# EAGLE design clock10 (EAGLE 7.7.0)

## Sheet 1 of 2
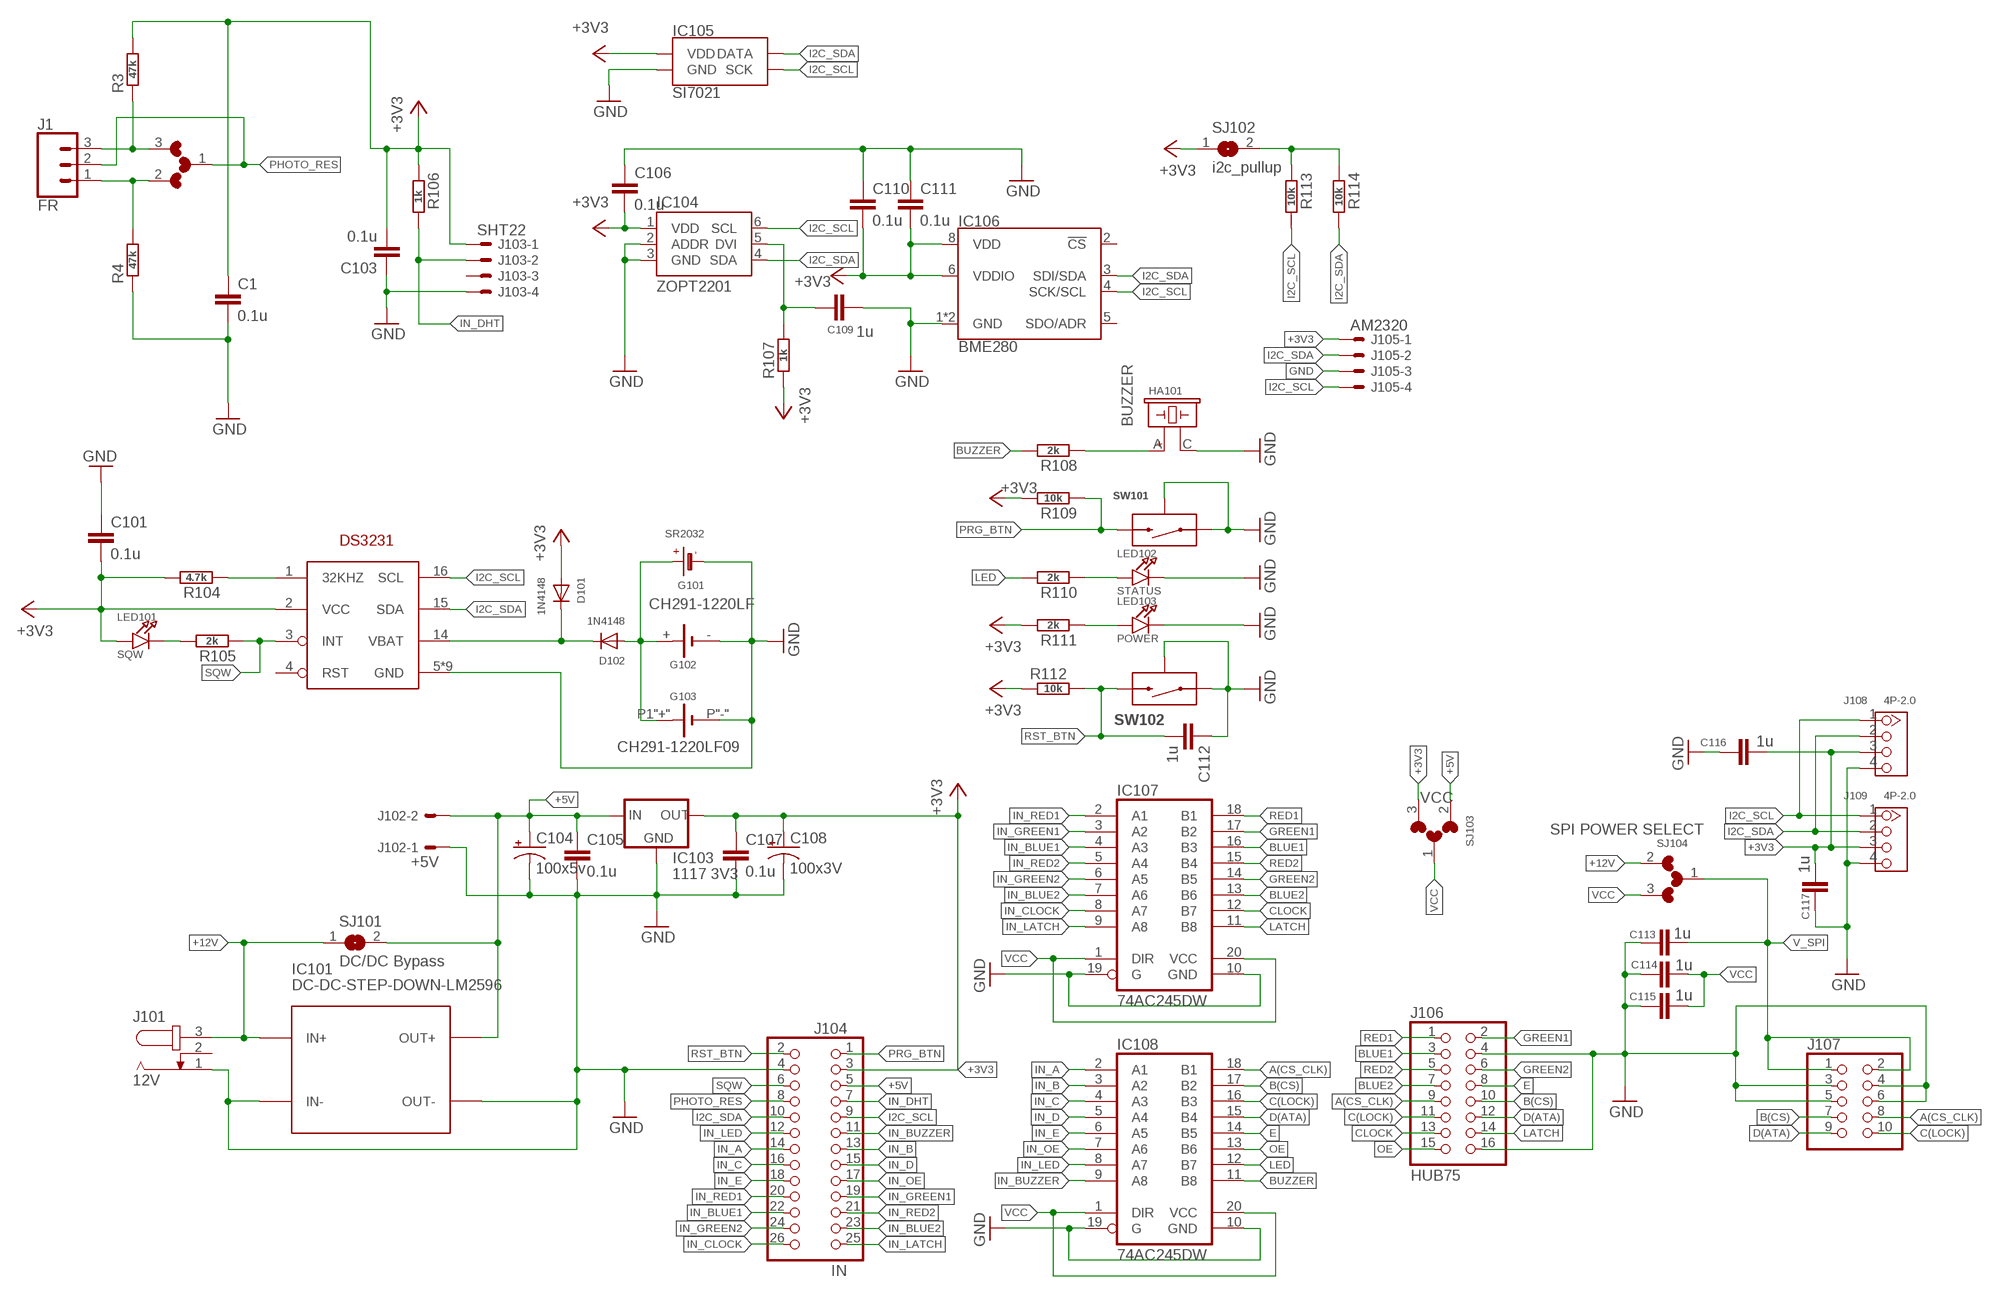
[diagram p0: schematic, sheet 1]

### Parts
C1  0.1u  CAP0603-CAP  [0603-CAP]
C101  0.1u  CAP0603-CAP  [0603-CAP]
C103  0.1u  CAP0603-CAP  [0603-CAP]
C104  100x5v  CAP_POLPTH1  [CPOL-RADIAL-100UF-25V]
C105  0.1u  CAP0603-CAP  [0603-CAP]
C106  0.1u  CAP0603-CAP  [0603-CAP]
C107  0.1u  CAP0603-CAP  [0603-CAP]
C108  100x3V  CAP_POLPTH1  [CPOL-RADIAL-100UF-25V]
C109  1u  CAP0603-CAP  [0603-CAP]
C110  0.1u  CAP0603-CAP  [0603-CAP]
C111  0.1u  CAP0603-CAP  [0603-CAP]
C112  1u  CAP0603-CAP  [0603-CAP]
C113  1u  CAP0603-CAP  [0603-CAP]
C114  1u  CAP0603-CAP  [0603-CAP]
C115  1u  CAP0603-CAP  [0603-CAP]
C116  1u  CAP0603-CAP  [0603-CAP]
C117  1u  CAP0603-CAP  [0603-CAP]
D101  1N4148  DIODESOD-323F  [SOD-323F]
D102  1N4148  DIODESOD-323F  [SOD-323F]
G101  SR2032  BATTERYCR2032  [CR2032]
G102  CH291-1220LF  [CH291-1220LF]
G103  CH291-1220LF09  [CH23-09LF]
HA101  BUZZER  PIEZO_BUZZERHYDZ12X7.5  [PBUZ_12X7.5]
IC101  DC-DC-STEP-DOWN-LM2596  [DC-DC-STEP-DOWN-LM2596]
IC102  DS3231W  [SO16W]
IC103  1117 3V3  V_REG_LD1117VXXSMD  [SOT223]
IC104  ZOPT2201  BH1750  [WSOF6L]
IC105  SI7021  [DFN-6-3X3-SI7021]
IC106  BME280  [LGA-8-2.5X2.5]
IC107  74AC245DW  [SO20W]
IC108  74AC245DW  [SO20W]
J1  FR  CONN_03  [1X03]
J101  12V  JACK-PLUG0  [SPC4077]
J102  +5V  C-GRID-02-70543  [70543-02]
J103  SHT22  C-GRID-04-70543  [70543-04]
J104  IN  HEADER-2X13  [2X13]
J105  AM2320  C-GRID-04-70543  [70543-04]
J106  HUB75  PINHD-2X8  [2X08]
J107  HEADER-2X5IDC  [2X05_IDC]
J108  4P-2.0  GROVE-CONNECTOR-DIP(4P-2.0)  [HW4-2.0]
J109  4P-2.0  GROVE-CONNECTOR-DIP(4P-2.0)  [HW4-2.0]
LED101  SQW  LED0603  [CHIPLED_0603]
LED102  STATUS  LED0603  [CHIPLED_0603]
LED103  POWER  LED0603  [CHIPLED_0603]
R3  47k  R-EU_R0603  [R0603]
R4  47k  R-EU_R0603  [R0603]
R104  4.7k  R-EU_R0603  [R0603]
R105  2k  R-EU_R0603  [R0603]
R106  1k  R-EU_R0603  [R0603]
R107  1k  R-EU_R0603  [R0603]
R108  2k  R-EU_R0603  [R0603]
R109  10k  R-EU_R0603  [R0603]
R110  2k  R-EU_R0603  [R0603]
R111  2k  R-EU_R0603  [R0603]
R112  10k  R-EU_R0603  [R0603]
R113  10k  R-EU_R0603  [R0603]
R114  10k  R-EU_R0603  [R0603]
SJ1  PR POS/NEG  MICROBUILDER_SOLDERJUMPER3  [MICROBUILDER_SOLDERJUMPER_ARROW_NOPASTE_3]
SJ101  DC/DC Bypass  MICROBUILDER_SOLDERJUMPER  [MICROBUILDER_SOLDERJUMPER_ARROW_NOPASTE]
SJ102  i2c_pullup  MICROBUILDER_SOLDERJUMPER  [MICROBUILDER_SOLDERJUMPER_ARROW_NOPASTE]
SJ103  VCC  MICROBUILDER_SOLDERJUMPER3  [MICROBUILDER_SOLDERJUMPER_ARROW_NOPASTE_3]
SJ104  SPI POWER SELECT  MICROBUILDER_SOLDERJUMPER3  [MICROBUILDER_SOLDERJUMPER_ARROW_NOPASTE_3]
SW101  PRG  MICROSWITCH-BUTTON  [MICROPUSH-BUT_TOP]
SW102  RST  MICROSWITCH-BUTTON  [MICROPUSH-BUT_TOP]

### Nets
+3V3: C1.1 C101.2 C103.2 C106.2 C107.1 C108.1(+) C110.2 C111.2 C116.2 C117.2 D101.A IC102.2(VCC) IC103.2(OUT) IC103.4(OUT) IC104.1(VDD) IC105.VDD IC106.6(VDDIO) IC106.8(VDD) J103.1 J104.3 J105.1 J108.3 J109.3 LED101.A R3.2 R104.2 R106.1 R107.1 R109.2 R111.2 R112.1 SJ102.1 SJ103.3
+5V: C104.1(+) C105.1 IC101.OUT+ IC103.3(IN) J102.2 J104.5 SJ101.2 SJ103.2
+12V: IC101.IN+ J101.3 SJ101.1 SJ104.2
A(CS_CLK): IC108.18(B1) J106.9 J107.8
B(CS): IC108.17(B2) J106.10 J107.7
BLUE1: IC107.16(B3) J106.3
BLUE2: IC107.13(B6) J106.7
BUZ: HA101.A R108.1
BUZZER: IC108.11(B8) R108.2
C(LOCK): IC108.16(B3) J106.11 J107.10
CLOCK: IC107.12(B7) J106.13
D(ATA): IC108.15(B4) J106.12 J107.9
E: IC108.14(B5) J106.8
GND: C1.2 C101.1 C103.1 C104.2(-) C105.2 C106.1 C107.2 C108.2(-) C109.2 C110.1 C111.1 C112.1 C113.2 C114.2 C115.2 C116.1 C117.1 G101.- G102.- G103.P"-"(-) HA101.C IC101.IN- IC101.OUT- IC102.5(GND) IC102.6(GND) IC102.7(GND) IC102.8(GND) IC102.9(GND) IC102.10(GND) IC102.11(GND) IC102.12(GND) IC102.13(GND) IC103.1(GND) IC104.2(ADDR) IC104.3(GND) IC105.GND IC106.1(GND) IC106.7(GND) IC107.10(GND) IC107.19(G) IC108.10(GND) IC108.19(G) J101.1 J102.1 J103.4 J104.4 J105.3 J106.4 J106.16 J107.3 J107.4 J107.5 J107.6 J108.4 J109.4 LED102.C LED103.C R4.1 SW101.A SW101.SH0(SH) SW102.A SW102.SH0(SH) ; also sheet 2
GREEN1: IC107.17(B2) J106.2
GREEN2: IC107.14(B5) J106.6
I2C_SCL: IC102.16(SCL) IC104.6(SCL) IC105.SCK IC106.4(SCK/SCL) J104.9 J105.4 J108.1 J109.1 R113.2
I2C_SDA: IC102.15(SDA) IC104.4(SDA) IC105.DATA IC106.3(SDI/SDA) J104.10 J105.2 J108.2 J109.2 R114.2
IN_A: IC108.2(A1) J104.14
IN_B: IC108.3(A2) J104.13
IN_BLUE1: IC107.4(A3) J104.22
IN_BLUE2: IC107.7(A6) J104.23
IN_BUZZER: IC108.9(A8) J104.11
IN_C: IC108.4(A3) J104.16
IN_CLOCK: IC107.8(A7) J104.26
IN_D: IC108.5(A4) J104.15
IN_DHT: J103.2 J104.7 R106.2
IN_E: IC108.6(A5) J104.18
IN_GREEN1: IC107.3(A2) J104.19
IN_GREEN2: IC107.6(A5) J104.24
IN_LATCH: IC107.9(A8) J104.25
IN_LED: IC108.8(A7) J104.12
IN_OE: IC108.7(A6) J104.17
IN_RED1: IC107.2(A1) J104.20
IN_RED2: IC107.5(A4) J104.21
LATCH: IC107.11(B8) J106.14
LED: IC108.12(B7) R110.2
N$1: D101.C D102.C IC102.14(VBAT)
N$2: LED103.A R111.1
N$4: J1.3 R3.1 SJ1.3
N$5: LED102.A R110.1
N$7: LED101.C R105.2
N$8: J1.1 R4.2 SJ1.2
N$25: C109.1 IC104.5(DVI) R107.2
N$32: IC102.1(32KHZ) R104.1
N$39: R113.1 R114.1 SJ102.2
N$52: D102.A G101.+ G102.+ G103.P1"+"(+)
OE: IC108.13(B6) J106.15
PHOTO_RES: J1.2 J104.8 SJ1.1
PRG_BTN: J104.1 R109.1 SW101.B
RED1: IC107.18(B1) J106.1
RED2: IC107.15(B4) J106.5
RST_BTN: C112.2 J104.2 R112.2 SW102.B
SQW: IC102.3(INT) J104.6 R105.1
V_SPI: C113.1 J107.1 J107.2 SJ104.1
VCC: C114.1 C115.1 IC107.1(DIR) IC107.20(VCC) IC108.1(DIR) IC108.20(VCC) SJ103.1 SJ104.3
Unconnected: IC102.4(RST) IC106.2(!CS) IC106.5(SDO/ADR) J101.2 J103.3

## Sheet 2 of 2
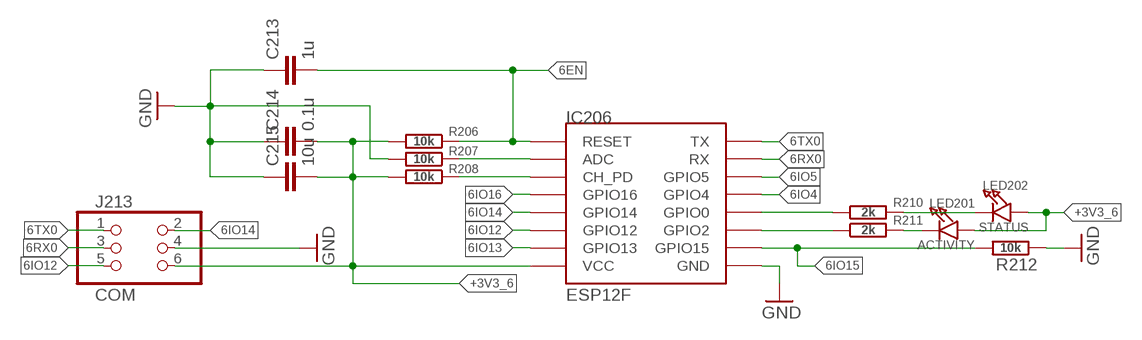
[diagram p1: schematic, sheet 2]

### Parts
C213  1u  CAP0603-CAP  [0603-CAP]
C214  0.1u  CAP0603-CAP  [0603-CAP]
C215  10u  CAP0603-CAP  [0603-CAP]
IC206  ESP12F  ESP12SMD  [ESP12-SMD]
J213  COM  HEADER-2X3SMT  [2X03_SMT]
LED201  ACTIVITY  LED0603  [CHIPLED_0603]
LED202  STATUS  LED0603  [CHIPLED_0603]
R206  10k  R-EU_R0603  [R0603]
R207  10k  R-EU_R0603  [R0603]
R208  10k  R-EU_R0603  [R0603]
R210  2k  R-EU_R0603  [R0603]
R211  2k  R-EU_R0603  [R0603]
R212  10k  R-EU_R0603  [R0603]

### Nets
6EN: C213.2 IC206.RESET R206.1
6IO0: IC206.GPIO0 R210.1
6IO2: IC206.GPIO2 R211.1
6IO4: IC206.GPIO4
6IO5: IC206.GPIO5
6IO12: IC206.GPIO12 J213.5
6IO13: IC206.GPIO13
6IO14: IC206.GPIO14 J213.2
6IO15: IC206.GPIO15 R212.2
6IO16: IC206.GPIO16
6RX0: IC206.RXD0(RX) J213.3
6TX0: IC206.TXD0(TX) J213.1
+3V3_6: C214.2 C215.2 IC206.VCC J213.6 LED201.A LED202.A R206.2 R208.2
GND: C213.1 C214.1 C215.1 IC206.GND J213.4 R207.2 R212.1 ; also sheet 1
N$9: IC206.CH_PD R208.1
N$10: IC206.ADC R207.1
N$11: LED202.C R210.2
N$12: LED201.C R211.2

## Library data of the parts
C1 C101 C103 C105-C107 C109-C117 C213-C215 = radiva5:CAP: Capacitor Standard 0603 ceramic capacitor, and 0.1" leaded capacitor.
C104 C108 = radiva5:CAP_POL: Capacitor Polarized These are standard SMD and PTH capacitors. Normally 10uF, 47uF, and 100uF in electrolytic and tantalum varieties. Always verify the external diameter of the through hole cap, it varies with capacity, voltage, and manufacturer. The EIA devices should be standard.
D101 D102 = clock02:DIODE: Diode SMADIODE - SMA Surface Mount Package 20V 1A Schottky Diode Digikey: 641-1014-6-ND DO-1N4148 - Through Hole Small Current Diode SOD-123 20V 1 A (.5mV Vf) Schottky Diode - Digikey: MBRX120TPMSCT-ND SOD-323 10V 570mA (.38mV Vf, 3ns) Schottky Diode - Digikey: ZLLS410CT-ND SOD-523 30V 30mA Schottky Diode (RB751S-40TE61) - Digikey: RB751S-40TE61CT-ND SOT23-R/W - SOT23 Package (R = Solder Paste/Reflow Ovens, W = Hand-Soldering) BAT54Film 40V 300mA - Digikey: 497-7162-1-ND
G101 = radiva5:BATTERY: CR1220 SMT - Digikey: 3001K-ND
G102 G103 = clock02:CH291-1220LF: Battery Holder, SMT, 12mm multicomp PART NO. CH291-1220LF Source: Data sheet <http://www.farnell.com/datasheets/1505860.pdf>
HA101 = radiva5:PIEZO_BUZZER: Generic Piezo Buzzer Package(s): 12 mm dia, 7.6 mm (Pitch)
IC101 = diy-modules:DC-DC-STEP-DOWN-LM2596: DC/DC Step-Down Regulator based on LM2596-ADJ chip LM2596 datasheet available here: http://www.ti.com/lit/ds/symlink/lm2596.pdf Click here to find device on ebay.com <http://www.ebay.com/sch/lm2596+power+regulator>
IC102 = radiva5:DS3231
IC103 = radiva5:V_REG_LD1117VXX: LD1117VXX voltage regulator. We carry the 3.3V version (COM-00526) in TO-220 package.; PROD_ID: VREG-13917
IC104 = radiva5:BH1750; PROD_ID: IC-13876
IC105 = radiva5:SI7021: Silicon Labs Si7021 I2C Humidity and Temperature Sensor The Si7021 is a low-cost, easy-to-use, highly accurate, digital humidity and temperature sensor. This sensor is ideal for environmental sensing and data logging and perfect for build a weather stations or humidor control system. All you need are two lines for I2C communication, and you’ll have relative humidity readings and very accurate temperature readings as a bonus! Datasheet <https://cdn.sparkfun.com/datasheets/Sensors/Weather/Si7021.pdf> SparkFun Products SparkFun Humidity and Temperature Sensor Breakout - Si7021 <https://www.sparkfun.com/products/13763> (SEN-13763) SparkFun Blynk Board - ESP8266 <https://www.sparkfun.com/products/13794> (WRL-13794); PROD_ID: IC-13093
IC106 = radiva5:BME280: Bosch BME280 – Combined Humidity and Pressure Sensor The BME280 is as combined digital humidity, pressure and temperature sensor based on proven sensing principles. The sensor module is housed in an extremely compact metal-lid LGA package with a footprint of only 2.5×2.5mm² with a height of 0.93mm. Its small dimensions and its low power consumption allow the implementation in battery driven devices such as handsets, GPS modules or watches. Datasheet <https://cdn.sparkfun.com/assets/learn_tutorials/4/1/9/BST-BME280_DS001-10.pdf> SparkFun Products SparkFun Atmospheric Sensor Breakout - BME280 <https://www.sparkfun.com/products/13676> (SEN-13676); PROD_ID: IC-13090
IC107 IC108 = 74xx-eu:74*245: Octal BUS TRANSCEIVER, 3-state
IC206 = esp8266modules:ESP12: ESP8266 Wifi module 12
J1 = radiva5:CONN_03: Multi connection point. Often used as Generic Header-pin footprint for 0.1 inch spaced/style header connections On any of the 0.1 inch spaced packages, you can populate with these: Break Away Headers - Straight <https://www.sparkfun.com/products/116> (PRT-00116) Break Away Male Headers - Right Angle <https://www.sparkfun.com/products/553> (PRT-00553) Female Headers <https://www.sparkfun.com/products/115> (PRT-00115) Break Away Headers - Machine Pin <https://www.sparkfun.com/products/117> (PRT-00117) Break Away Female Headers - Swiss Machine Pin <https://www.sparkfun.com/products/743> (PRT-00743) Stackable Header - 3 Pin (Female, 0.1") <https://www.sparkfun.com/products/13875> (PRT-13875) For SCREWTERMINALS and SPRING TERMINALS visit here: Screw Terimnals on SparkFun.com <https://www.sparkfun.com/search/results?term=Screw+Terminals> (5mm/3.5mm/2.54mm spacing) This device is also useful as a general connection point to wire up your design to another part of your project. Our various solder wires solder well into these plated through hole pads. Hook-Up Wire - Assortment (Stranded, 22 AWG) <https://www.sparkfun.com/products/11375> (PRT-11375) Hook-Up Wire - Assortment (Solid Core, 22 AWG) <https://www.sparkfun.com/products/11367> (PRT-11367) View the entire wire category on our website here <https://www.sparkfun.com/categories/141> Special notes: Molex polarized connector foot print use with SKU : PRT-08232 with associated crimp pins and housings.; PROD_ID: XXX-00000; VALUE: 455-1750-1-ND
J101 = con-jack:JACK-PLUG: DC POWER JACK Power Jack, DC, Right Angle, Through Hole, Rated 5A at 16VDC, PC Terminals Distributor: Farnell (www.Farnell.de) Drawing: 84N1161.pdf / 84N1162.pdf Manufacturer: SPC Technology (www.spctechnology.com) Type: SPC4077 / SPC 4078; OC_FARNELL: unknown; OC_NEWARK: unknown
J102 = con-molex:C-GRID-02: CONNECTOR wire to board 2.54 mm (0.100") pitch header; OC_FARNELL: unknown; OC_NEWARK: unknown
J103 J105 = con-molex:C-GRID-04: CONNECTOR wire to board 2.54 mm (0.100") pitch header; OC_FARNELL: unknown; OC_NEWARK: unknown
J104 = radiva5:HEADER-2X13: PIN HEADER
J106 = pinhead:PINHD-2X8: PIN HEADER
J107 = radiva5:HEADER-2X5: PIN HEADER
J108 J109 = radiva5:GROVE-CONNECTOR-DIP(4P-2.0): 320110033
J213 = radiva5:HEADER-2X3: PIN HEADER
LED101-LED103 LED201 LED202 = radiva5:LED: LED 0603 - 0603 Surface Mount Package 2mA: Green LED - Low Power (3.9mcd, 2ma, 1.7Vf) - Digikey: 475-2709-2-ND Orange LED - Low Power (9.8mcd, 2ma, 1.8Vf) - Digikey: 475-1194-2-ND Red LED - Low Power (5mcd, 2ma, 1.8Vf) - Digikey: 475-1195-2-ND Yellow LED - Low Power (7mcd, 2ma, 1.8Vf) - Digikey: 475-1196-2-ND 5mA: Blue LED - Low Power (17mcd, 5ma, 2.9Vf) - Digikey: LNJ937W8CRACT-ND 0805 - 0805 Surface Mount Package 2mA: Red LED (8.8mcd, 2mA, 1.8Vf, Clear) - Low Power [Digikey: 475-2510-1-ND] Green LED (5mcd, 2mA, 1.8Vf, Clear) - Low Power [Digikey: 475-2730-1-ND] Yellow LED (11.3mcd, 2mA, 1.8Vf, Clear) - Low Power [Digikey: 475-2555-1-ND] 20mA: Red LED (104mcd, 20mA, Diffused) - LS R976 [Digikey: 475-1278-6-ND] Red LED (12mcd, 20mA, 2.0Vf, Clear) - APT2012EC [Digikey: 754-1128-1-ND] Green LED (15mcd, 20mA, 2.2Vf, Clear) - APT2012GC [Digikey: 754-1131-1-ND] Orange LED (160mcd, 20mA, 2.1Vf, Clear) - APT2012SECK [Digikey: 754-1130-1-ND] 1206 - 1206 Surface Mount Package Green LED (26mcd, 20mA, Diffused) - LG N971 [Digikey: 475-1407-6-ND] Red LED (15mcd, 20mA, Diffused) - LH N974 [Digikey: 475-1416-6-ND]
R3 R4 R104-R114 R206-R208 R210-R212 = radiva5:R-EU_: RESISTOR, European symbol
SJ1 SJ103 SJ104 = radiva5:MICROBUILDER_SOLDERJUMPER3: SMD Solder JUMPER Solder the two pads together to create a connection, or remove the solder to break it. REFLOW - Use this footprint for solder paste and reflow ovens. WAVE - Use this footprint for hand-soldering (larger pads). CLOSED - Has a trace between the two pads to ensure it is closed by default. The trace needs to be cut to disable the jumper, and can be closed again by creating a solder bridge between the two pads.
SJ101 SJ102 = radiva5:MICROBUILDER_SOLDERJUMPER: SMD Solder JUMPER Solder the two pads together to create a connection, or remove the solder to break it. REFLOW - Use this footprint for solder paste and reflow ovens. WAVE - Use this footprint for hand-soldering (larger pads). CLOSED - Has a trace between the two pads to ensure it is closed by default. The trace needs to be cut to disable the jumper, and can be closed again by creating a solder bridge between the two pads.; BOM: EXCLUDE
SW101 SW102 = radiva5:MICROSWITCH-BUTTON

## Net classes
0 default: clearance 0.205 mm
1 power: width 0.406 mm

## Board
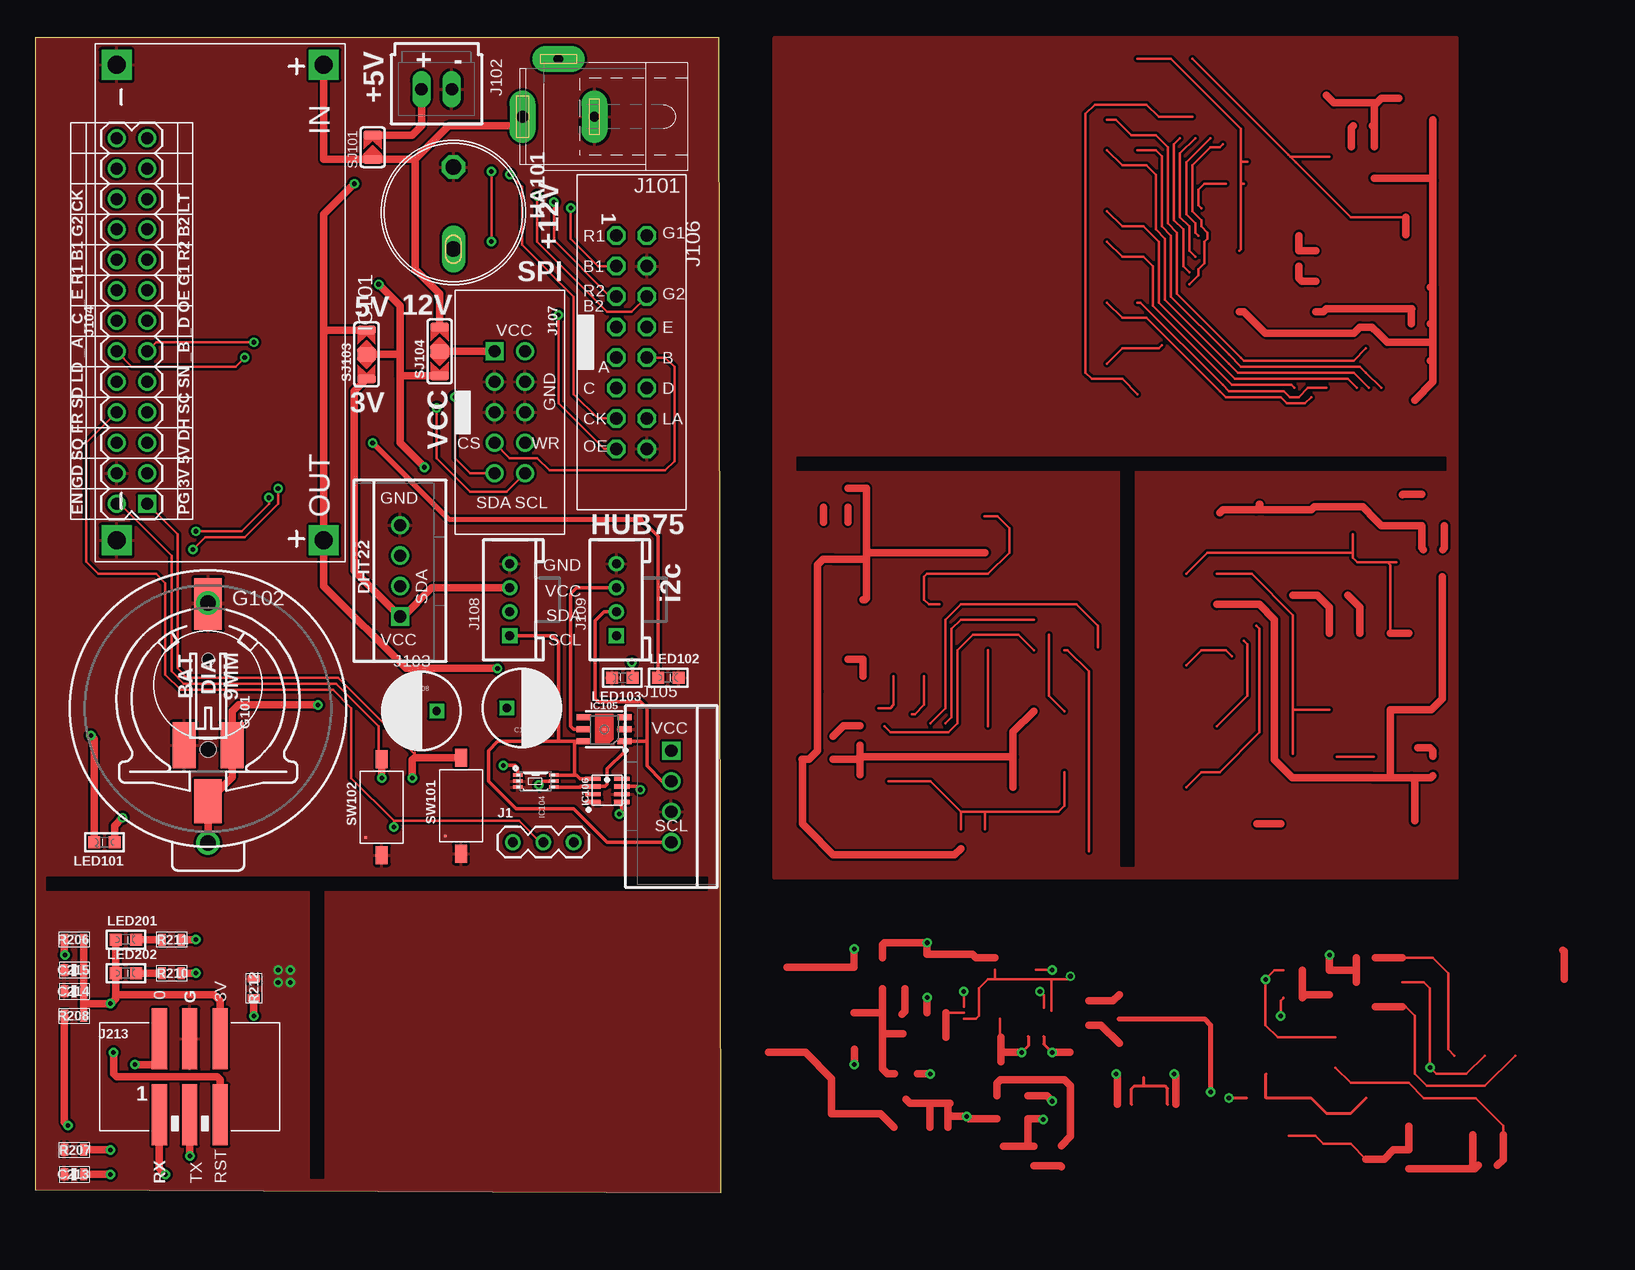
[diagram p2: board, top side]
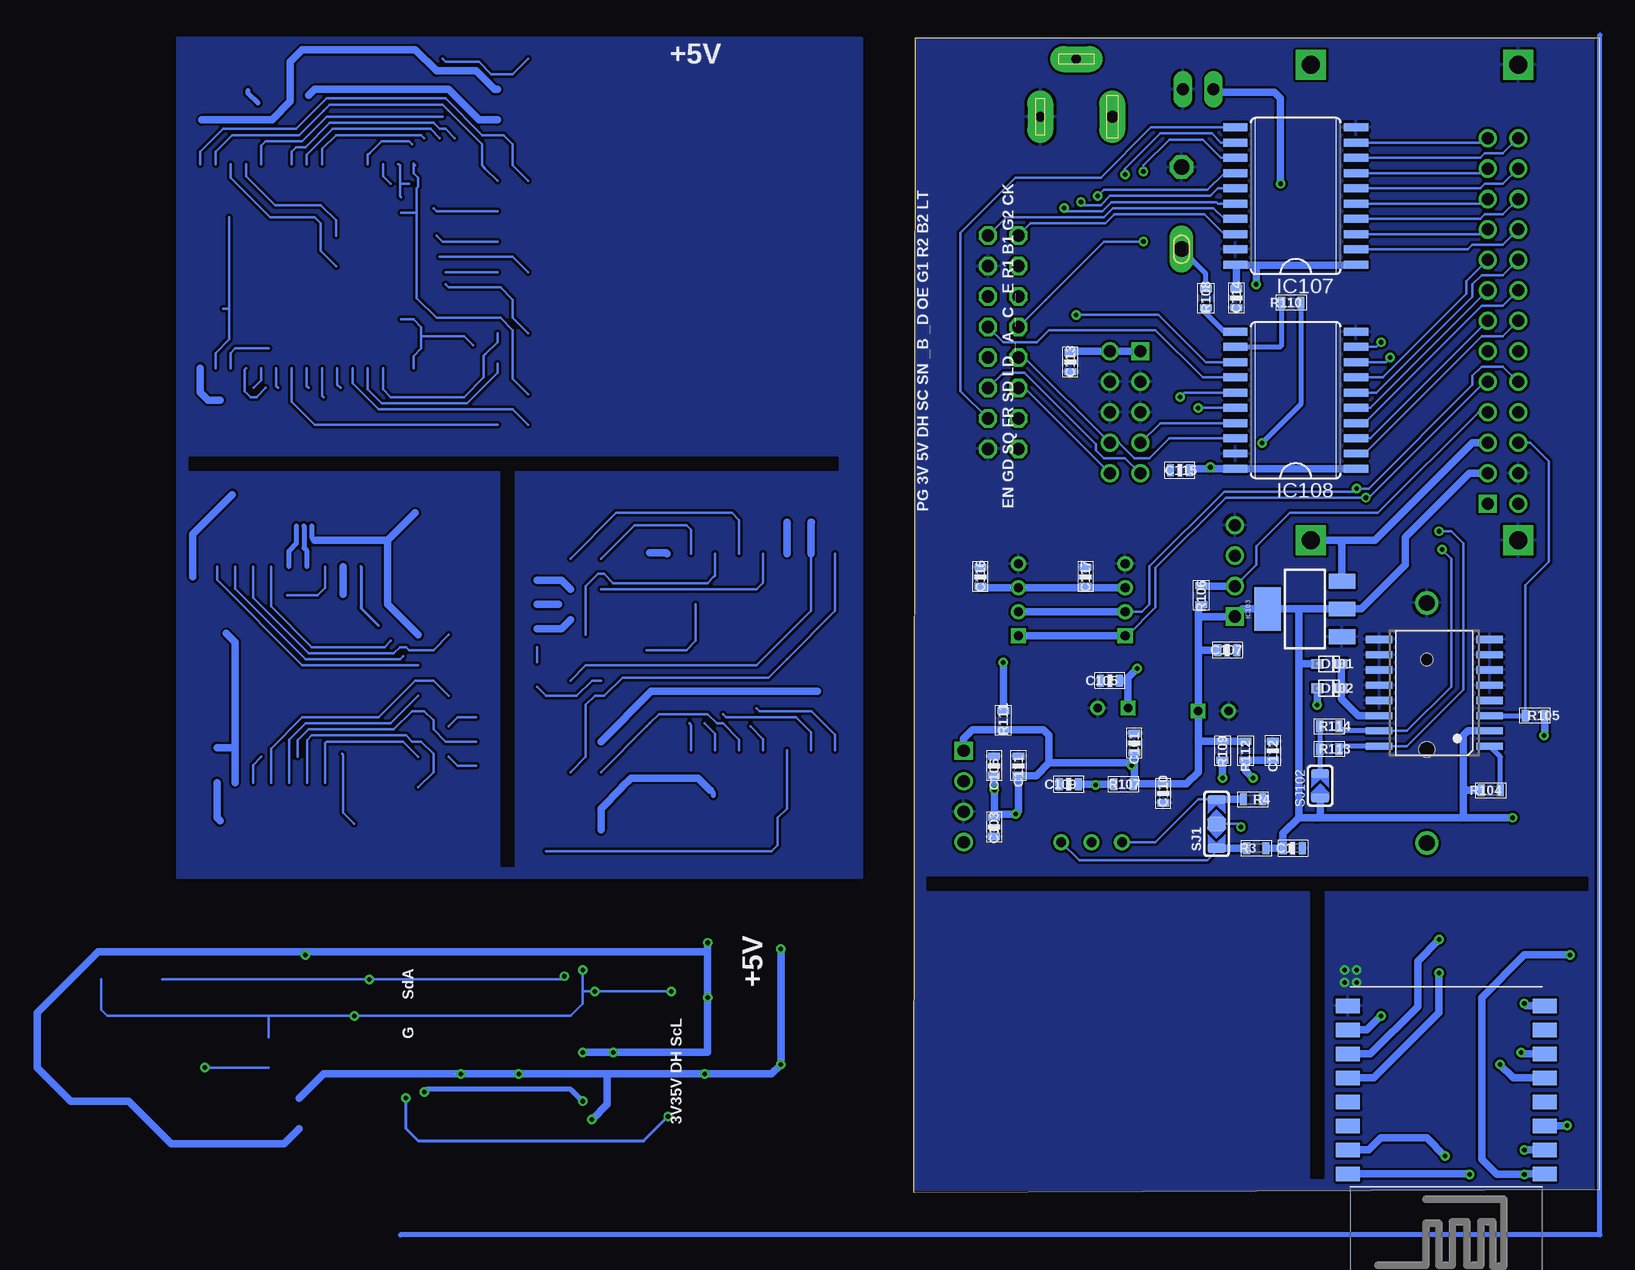
[diagram p3: board, bottom side, seen from below]

Size 57.14 x 96.25 mm. Coordinates in mm from the lower left corner, seen from the top.
Outline: 0,96.25 0,0.25 57.14,0 57,96.25 0,96.25
Copper layers (1*16): Top 0.035mm / dielectric 1.5mm / Bottom 0.035mm
Design rules "default *": minimum track width 8mil, minimum drill 15mil, track to track 8mil, track to pad 8mil, pad to pad 8mil, via to via 8mil, smd to smd 8mil, copper to edge 1mil, drill to drill 8mil, minimum pad ring 10mil, minimum via ring 8mil, stop-mask expansion 4mil, vias tented up to drill 20mil, thermal gap 10mil

### Footprints (pad centres in the part's own frame; a part is rotated, then mirrored left to right if it is on the bottom)
0603-CAP = smd 0.6 x 1: 1 -0.8,0; 2 0.8,0
CPOL-RADIAL-100UF-25V = drill 0.7 square: 1 1.27,0 | drill 0.7: 2 -1.27,0
SOD-323F = smd 1 x 0.8: A -1,0; C 1,0
CR2032 = drill 1.3: + 11.5,0; - -8.5,0
CH291-1220LF = smd 2.3 x 3.66: + 0,-2.296 | smd 2.3 x 4.3: - 0,14.146 | hole 1.3: 0,2 | hole 1: 0,9.5
CH23-09LF = smd 3.81 x 1.93: P1"+" 5,2; P"-" 5,-2
PBUZ_12X7.5 = drill 1.3 long: A 3.038,0 | drill 1.3 octagon: C -3.8,0
DC-DC-STEP-DOWN-LM2596 = drill 1.5 pad 2.5 square: IN+ -19.812,8.636; IN- -19.812,-8.636; OUT+ 19.812,8.636; OUT- 19.812,-8.636
SO16W = smd 0.6 x 2.2: 1 -4.445,-4.6; 2 -3.175,-4.6; 3 -1.905,-4.6; 4 -0.635,-4.6; 5 0.635,-4.6; 6 1.905,-4.6; 7 3.175,-4.6; 8 4.445,-4.6; 9 4.445,4.6; 10 3.175,4.6; 11 1.905,4.6; 12 0.635,4.6; 13 -0.635,4.6; 14 -1.905,4.6; 15 -3.175,4.6; 16 -4.445,4.6
SOT223 = smd 1.219 x 2.235: 1 -2.311,-3.099; 2 0,-3.099; 3 2.311,-3.099 | smd 3.6 x 2.2: 4 0,3.099
WSOF6L = smd 0.3 x 0.8: 1 -0.5,-1.5; 2 0,-1.5; 3 0.5,-1.5; 4 0.5,1.5; 5 0,1.5; 6 -0.5,1.5
DFN-6-3X3-SI7021 = smd 0.2 x 0.2: 7 0,0 | smd 1.2 x 0.5: DATA 1.7,-1; GND 1.7,0; NC@3 1.7,1; NC@4 -1.7,1; SCK -1.7,-1; VDD -1.7,0
LGA-8-2.5X2.5 = smd 0.35 x 1.3: 1 -0.975,1.2; 2 -0.325,1.2; 3 0.325,1.2; 4 0.975,1.2; 5 0.975,-1.2; 6 0.325,-1.2; 7 -0.325,-1.2; 8 -0.975,-1.2
SO20W = smd 0.66 x 2.032: 1 -5.715,-5.029; 2 -4.445,-5.029; 3 -3.175,-5.029; 4 -1.905,-5.029; 5 -0.635,-5.029; 6 0.635,-5.029; 7 1.905,-5.029; 8 3.175,-5.029; 9 4.445,-5.029; 10 5.715,-5.029; 11 5.715,5.029; 12 4.445,5.029; 13 3.175,5.029; 14 1.905,5.029; 15 0.635,5.029; 16 -0.635,5.029; 17 -1.905,5.029; 18 -3.175,5.029; 19 -4.445,5.029; 20 -5.715,5.029
ESP12-SMD = smd 2 x 1.2: ADC -8.3,3.8; CH_PD -8.3,1.8; GND 8.1,-8.2; GPIO0 8.1,-2.2; GPIO2 8.1,-4.2; GPIO4 8.1,-0.2; GPIO5 8.1,1.8; GPIO12 -8.3,-4.2; GPIO13 -8.3,-6.2; GPIO14 -8.3,-2.2; GPIO15 8.1,-6.2; GPIO16 -8.3,-0.2; RESET -8.3,5.8; RXD0 8.1,3.8; TXD0 8.1,5.8; VCC -8.3,-8.2
1X03 = drill 0.813: 1 0,0; 2 2.54,0; 3 5.08,0
SPC4077 = drill 0.8 pad 2.184 long: 1 -3,0; 2 0,-4.8 | drill 1 pad 2.184 long: 3 3,0
70543-02 = drill 1.016 long: 1 -1.27,0; 2 1.27,0
70543-04 = drill 1.016 square: 1 -3.81,0 | drill 1.016: 2 -1.27,0; 3 1.27,0; 4 3.81,0
2X13 = drill 1 square: 1 -15.24,-1.27 | drill 1: 2 -15.24,1.27; 3 -12.7,-1.27; 4 -12.7,1.27; 5 -10.16,-1.27; 6 -10.16,1.27; 7 -7.62,-1.27; 8 -7.62,1.27; 9 -5.08,-1.27; 10 -5.08,1.27; 11 -2.54,-1.27; 12 -2.54,1.27; 13 0,-1.27; 14 0,1.27; 15 2.54,-1.27; 16 2.54,1.27; 17 5.08,-1.27; 18 5.08,1.27; 19 7.62,-1.27; 20 7.62,1.27; 21 10.16,-1.27; 22 10.16,1.27; 23 12.7,-1.27; 24 12.7,1.27; 25 15.24,-1.27; 26 15.24,1.27
2X08 = drill 1.016 octagon: 1 -8.89,-1.27; 2 -8.89,1.27; 3 -6.35,-1.27; 4 -6.35,1.27; 5 -3.81,-1.27; 6 -3.81,1.27; 7 -1.27,-1.27; 8 -1.27,1.27; 9 1.27,-1.27; 10 1.27,1.27; 11 3.81,-1.27; 12 3.81,1.27; 13 6.35,-1.27; 14 6.35,1.27; 15 8.89,-1.27; 16 8.89,1.27
2X05_IDC = drill 1 square: 1 -5.08,-1.27 | drill 1: 2 -5.08,1.27; 3 -2.54,-1.27; 4 -2.54,1.27; 5 0,-1.27; 6 0,1.27; 7 2.54,-1.27; 8 2.54,1.27; 9 5.08,-1.27; 10 5.08,1.27
HW4-2.0 = drill 0.762 pad 1.27 square: 1 -3,0 | drill 0.762 pad 1.27: 2 -1,0; 3 1,0; 4 3,0
2X03_SMT = smd 1.27 x 5.08: 1 -2.54,-3.175; 2 -2.54,3.175; 3 0,-3.175; 4 0,3.175; 5 2.54,-3.175; 6 2.54,3.175
CHIPLED_0603 = smd 1 x 1: A 0,-0.85; C 0,0.85
R0603 = smd 0.6 x 1: 1 -0.8,0; 2 0.8,0
MICROBUILDER_SOLDERJUMPER_ARROW_NOPASTE_3 = smd 1.27 x 1.524: 1 0,0 | smd 0.762 x 1.524: 2 2.032,0; 3 -2.032,0
MICROBUILDER_SOLDERJUMPER_ARROW_NOPASTE = smd 0.762 x 1.524: 1 -1.016,0; 2 1.016,0
MICROPUSH-BUT_TOP = smd 1.5 x 1: A -4,0; B 4,0 | smd 0.2 x 0.2: SH0 -2.54,1.31

### Placement (x,y rotation side)
C1  25.57,28.73 0 bottom
C101  38.78,37.49 270 bottom
C103  50.47,30.51 90 bottom
C104  40.56,40.41 180 top
C105  40.81,42.7 180 bottom
C106  50.47,35.59 270 bottom
C107  31.04,45.24 0 bottom
C108  32.18,40.16 0 top
C109  44.24,34.06 180 bottom
C110  36.37,33.3 90 bottom
C111  48.43,35.59 270 bottom
C112  27.22,36.86 270 bottom
C113  44.12,69.24 270 bottom
C114  30.27,74.58 270 bottom
C115  34.97,60.22 180 bottom
C116  51.61,51.33 270 bottom
C117  42.85,51.33 270 bottom
C213  3.22,1.55 0 top
C214  3.22,16.79 0 top
C215  3.22,18.57 0 top
D101  22.53,44.1 0 bottom
D102  22.53,42.06 0 bottom
G101  14.4,40.67 270 top
G102  14.4,34.95 0 top
G103  14.4,42.32 270 top
HA101  34.84,81.69 270 top
IC101  15.41,74.19 270 top
IC102  13.76,41.68 90 bottom
IC103  24.56,48.67 90 bottom
IC104  41.7,34.32 270 top
IC105  47.42,38.63 0 top
IC106  47.67,33.55 90 top
IC107  25.32,83.08 90 bottom
IC108  25.32,66.07 90 bottom
IC206  12.87,7.39 180 bottom
J1  39.8,29.24 0 top
J101  43.61,89.69 180 top
J102  33.45,91.97 180 top
J103  30.4,51.84 90 top
J104  8.05,72.67 90 top
J105  53.01,33.05 270 top
J106  49.7,70.89 270 top
J107  39.54,65.05 270 top
J108  39.54,49.43 90 top
J109  48.43,49.43 90 top
J213  12.87,9.68 0 top
LED101  5.76,29.24 90 top
LED102  52.75,42.95 270 top
LED103  48.94,42.95 90 top
LED201  7.54,21.11 270 top
LED202  7.54,18.31 270 top
R3  28.62,28.73 0 bottom
R4  28.88,32.79 180 bottom
R104  9.06,33.55 180 bottom
R105  5.38,39.78 0 bottom
R106  33.19,49.81 90 bottom
R107  39.67,34.06 180 bottom
R108  32.81,74.58 270 bottom
R109  31.42,36.86 90 bottom
R110  25.7,74.19 180 bottom
R111  49.7,39.4 270 bottom
R112  29.51,36.86 270 bottom
R113  22.53,36.98 0 bottom
R114  22.53,38.89 0 bottom
R206  3.22,21.11 0 top
R207  3.22,3.58 180 top
R208  3.22,14.76 0 top
R210  11.35,18.31 180 top
R211  11.35,21.11 180 top
R212  18.21,17.04 270 top
SJ1  31.92,30.76 90 bottom
SJ101  28.11,87.15 90 top
SJ102  23.29,33.94 90 bottom
SJ103  27.61,69.88 90 top
SJ104  33.7,70.13 90 top
SW101  35.48,32.28 90 top
SW102  28.88,32.16 90 top

### Tracks (layer width: path | path; a pad name or v marks a point on that pad's centre or on a via)
1EN_P
  Top 0.61: 109.71,87.18 109.71,88.78 109.86,88.93
2D+
  Bottom 0.406: 108.63,55.57 108.63,54.13 109.25,53.51 109.25,52.21
2D-
  Bottom 0.406: 107.98,55.57 107.98,53.73 107.75,53.5 107.75,52.21
2EN
  Top 0.203: 109.84,54.89 109.84,53.37 | 109.84,53.37 109.84,52.92 110.19,52.57 112.7,52.57 | 109.84,53.37 97.71,53.37 95.93,51.59 | 113.46,52.57 112.7,52.57 | 112.95,46.64 112.95,52.31 112.7,52.57
  Top 0.61: 112.95,46.64 114.47,46.64 | 116.51,36.39 116.51,36.86 116.25,37.11 115.24,37.11
  Bottom 0.61: 113.75,34.21 113.75,37.11 | 113.75,37.11 113.75,45.91 114.47,46.64 | 115.24,37.11 113.75,37.11
2EN_P
  Top 0.61: 117.46,55.62 117.46,53.77 117.31,53.62
2IO0
  Bottom 0.203: 115.25,52.21 115.25,51.09 108.12,43.97 98.47,43.97
2IO1
  Top 0.203: 95.93,43.97 97.2,45.24 99.23,45.24 99.74,44.73
  Bottom 0.203: 113.75,52.21 113.75,50.35 107.87,44.48 100,44.48 99.74,44.73
2IO2
  Bottom 0.203: 112.25,52.21 112.25,49.62 107.62,44.98 100.5,44.98 100,45.49 99.49,45.49 99.23,45.24 97.2,45.24 95.93,46.51
2IO3
  Top 0.203: 98.47,38.89 101.01,41.43 101.01,45.75 100.76,46
  Bottom 0.203: 110.75,52.21 110.75,48.88 107.36,45.49 101.27,45.49 100.76,46
2IO4
  Top 0.203: 108.5,36.35 111.55,36.35
  Bottom 0.203: 112.25,34.21 112.25,35.65 111.55,36.35 | 108.5,36.35 108.5,37.75 107.62,38.63 100.5,38.63 98.98,40.16 97.96,40.16 97.2,39.4 97.2,38.63 96.19,37.62 93.65,37.62
2IO5
  Bottom 0.203: 95.93,41.43 97.2,42.7 98.73,42.7 101.77,39.65 108.12,39.65 110.75,37.03 110.75,34.21
2IO6
  Bottom 0.203: 98.47,41.43 100.76,39.14 107.87,39.14 109.25,37.76 109.25,34.21
2IO7
  Bottom 0.203: 107.75,34.21 107.75,37.74 107.36,38.13 99.49,38.13 98.98,37.62 98.22,37.62 97.2,36.6 97.2,35.08 98.47,33.81
2IO8
  Bottom 0.203: 106.25,34.21 106.25,37.46 106.09,37.62 99.74,37.62 98.47,36.35
2IO9
  Top 0.203: 104.82,36.6 104.82,40.41 | 104.82,40.41 104.82,48.16 101.39,51.59 98.47,51.59 | 107.87,40.29 104.95,40.29 104.82,40.41
  Top 0.61: 101.84,30.76 103.81,30.76
  Bottom 0.203: 104.82,36.6 104.75,36.53 104.75,34.21 104.75,31.7 103.81,30.76
2IO10
  Top 0.203: 95.93,33.81 97.2,35.08 98.73,35.08 102.03,38.38 102.03,47.02 101.77,47.27
  Bottom 0.254: 103.25,52.21 103.25,48.74 101.77,47.27
2RX0
  Top 0.61: 104.82,49.81 106.85,49.81 107.87,48.79 107.87,46.64
  Bottom 0.203: 104.75,49.88 104.82,49.81
  Bottom 0.61: 104.75,52.21 104.75,49.88
2TX0
  Top 0.61: 110.41,46.64 110.41,48.79 109.39,49.81
  Bottom 0.203: 106.25,52.21 106.25,50.42 106.85,49.81 109.39,49.81
3ADC
  Top 0.61: 65.71,55.91 65.71,57.14
  Bottom 0.203: 65.72,53.28 65.72,48.53 70.28,43.97 84.5,43.97 85.77,42.7
  Bottom 0.61: 65.72,53.28 65.72,55.9 65.71,55.91
3EN
  Top 0.203: 85.77,35.08 85.77,32.28 85.26,31.78 79.17,31.78 | 79.17,31.78 77.14,31.78 | 79.17,30.29 79.17,31.78 | 77.14,30.29 77.14,31.78 | 71.1,34.32 74.6,34.32 77.14,31.78
  Top 0.61: 67.74,44.48 69.01,44.48 69.01,43.08
  Bottom 0.203: 63.72,53.28 63.72,48.5 67.74,44.48 69.26,42.95 81.45,42.95 82.98,41.43 83.74,41.43 84.5,40.67 84.5,36.35 85.77,35.08
3EN_P
  Top 0.61: 68.75,38.93 67.36,38.93 66.5,38.06
3IO0
  Top 0.203: 74.09,49.43 74.09,49.81 74.09,49.43 | 79.42,45.24 79.42,38.89 | 75.36,49.05 74.47,49.05 74.09,49.43 | 79.1,56.41 80.18,56.41 81.2,55.4 81.2,53.37 79.42,51.59 74.34,51.59 74.09,51.33 74.09,49.43
  Bottom 0.203: 83.23,35.08 79.42,38.89 79.17,39.14 78.41,39.9 74.34,39.9 73.58,39.14 73.07,39.14 71.72,37.79 71.72,36.88 | 79.42,45.24 76.12,45.24 75.36,46 75.36,49.05
3IO2
  Top 0.203: 88.57,45.49 88.57,47.27 86.79,49.05 77.14,49.05 75.87,47.78 75.87,40.41 74.6,39.14
  Bottom 0.203: 88.57,44.22 88.57,45.49 | 73.72,36.88 73.72,38.26 74.6,39.14
  Bottom 0.61: 88.57,49.05 86.79,49.05
3IO4
  Top 0.203: 85.77,45.24 86.03,45.24 87.8,43.46 87.8,28.47
  Bottom 0.203: 87.8,28.47 69.01,28.47 68.5,28.98 68.5,31.27 67.74,32.03 67.74,36.86 67.72,36.88
3IO5
  Top 0.203: 70.79,38.89 71.29,38.38 76.12,38.38 76.88,39.14 76.88,45.24 78.15,46.51 81.96,46.51 83.23,45.24
  Bottom 0.203: 69.72,36.88 69.72,37.82 70.79,38.89
3IO12
  Top 0.203: 85.77,40.16 84.5,41.43 84.5,46.51
  Bottom 0.203: 73.72,53.28 73.72,51.45 73.83,51.33 74.34,50.83 80.69,50.83 82.22,50.83 82.98,51.59 83.49,51.59 84.5,50.57 84.5,46.51
3IO13
  Bottom 0.203: 75.72,53.28 75.72,55.25 76.12,55.65 80.44,55.65 83.23,52.86
3IO14
  Bottom 0.203: 71.72,53.28 71.72,56.07 72.31,56.67 81.96,56.67 85.77,52.86
3IO15
  Top 0.203: 75.87,39.14 76.37,39.65 76.37,47.02 77.14,47.78 83.23,47.78
  Bottom 0.203: 75.72,36.88 75.72,38.99 75.87,39.14
3IO16
  Bottom 0.203: 83.23,50.32 70.28,50.32 69.77,50.83 69.72,50.88 69.72,53.28
3RX0
  Top 0.203: 74.09,43.08 74.09,40.67 73.33,39.9 73.07,39.9
  Bottom 0.203: 73.07,39.9 72.82,39.65 72.31,39.65 71.29,39.65 70.53,39.65 66.98,39.65 65.72,38.39 65.72,36.88
3TX0
  Top 0.203: 71.55,43.08 71.55,41.17 71.55,40.67 71.29,40.41 70.28,40.41
  Bottom 0.203: 63.72,36.88 63.72,38.17 65.71,40.16 70.02,40.16 70.28,40.41
4EN
  Top 0.203: 104.61,86.35 104.44,86.51 | 104.44,86.51 96.44,94.51 | 104.61,86.35 105.08,85.88 109.65,81.31 114.22,81.31 | 107.87,86.35 104.61,86.35 | 104.61,86.35 104.44,86.51
  Top 0.61: 114.69,72.42 114.69,73.65 114.73,73.69 107.62,73.69 107.36,73.43 106.73,73.43 | 114.22,79.85 114.22,81.31
  Bottom 0.203: 115.37,68.74 115.37,70 114.22,71.15 114.22,73.69 | 114.22,81.31 114.22,73.69 | 89.33,94.51 90.6,93.24 92.38,93.24 93.39,94.26 96.19,94.26 96.44,94.51 | 114.73,73.69 114.22,73.69
4IO0
  Top 0.203: 100.76,84.1 100.5,84.1 | 100.5,84.1 100.5,85.88 | 100.5,85.88 100.5,86 100.5,88.67 94.66,94.51 91.87,94.51 | 100.5,84.1 100.5,78.64 100.38,78.51 | 101.01,85.94 100.57,85.94 100.5,85.88
  Bottom 0.203: 101.4,85.74 101.4,84.74 100.76,84.1
4IO2
  Top 0.203: 99.23,84.1 97.46,84.1 96.95,83.59 96.95,82.32 97.2,82.07
  Bottom 0.203: 100.13,85.74 100.11,85.74 100,85.62 100,84.1 | 100,84.1 100,83.04 99.91,82.96 | 99.23,84.1 100,84.1 | 91.87,81.81 96.95,81.81 97.2,82.07
4IO4
  Top 0.203: 96.19,75.72 96.95,76.48 96.95,76.99 97.46,77.5 97.46,79.27 97.71,79.53 97.71,80.04 97.2,80.54 97.2,81.05 96.44,81.81 96.44,85.62 97.96,87.15 98.73,87.15 98.98,87.4
  Bottom 0.203: 96.19,75.72 95.93,75.46 91.61,75.46 90.6,74.45 90.6,72.92 89.33,71.65 | 98.98,87.4 99.23,87.66 101.52,87.66 102.54,86.64 102.67,86.51 102.67,85.74
4IO5
  Top 0.203: 97.96,87.91 95.93,85.88 95.93,81.56 96.69,80.8 96.69,80.04 96.95,79.78
  Bottom 0.203: 106.48,85.74 106.48,87.01 105.33,88.16 98.22,88.16 97.96,87.91 | 91.87,79.27 96.44,79.27 96.95,79.78
4IO12
  Bottom 0.203: 101.4,68.74 101.4,66.96 100.76,66.32 94.66,66.32 93.01,67.97 93.01,69.75 92.88,69.88 91.87,70.89 91.87,71.65
4IO13
  Top 0.203: 89.33,69.11 90.6,70.38 93.65,70.38 93.9,70.64
  Bottom 0.203: 98.86,68.74 98.86,69.74 98.22,70.38 98.22,71.4 | 98.22,71.4 98.22,72.16 98.85,72.8 99.91,72.8 | 93.9,70.64 94.66,71.4 98.22,71.4
4IO14
  Bottom 0.203: 102.67,68.74 102.67,66.96 101.52,65.81 94.41,65.81 91.87,68.35 91.87,69.11
4IO15
  Bottom 0.203: 89.33,66.57 90.6,67.84 90.6,71.91 91.61,72.92 96.95,72.92 98.6,74.58 98.6,81.69 | 98.73,85.62 98.86,85.76 98.86,85.74 98.86,85 98.47,84.61 98.47,83.85 98.6,83.72 98.6,81.69 | 99.91,81.69 98.6,81.69
4IO18
  Top 0.203: 96.69,87.91 95.42,86.64 95.42,81.31 96.19,80.54 96.19,78.51 96.69,78
  Bottom 0.203: 107.75,85.74 107.75,86.51 105.58,88.67 97.46,88.67 96.69,87.91 | 89.33,76.73 90.6,78 95.93,78 96.69,78
4IO19
  Top 0.203: 95.42,87.91 94.92,87.4 94.92,81.05 95.68,80.29 95.68,77.24 96.19,76.73
  Bottom 0.203: 91.87,76.73 96.19,76.73 | 109.02,85.74 109.02,86.76 108.63,87.15 107.87,87.15 105.84,89.18 97.2,89.18 96.69,88.67 96.19,88.67 95.42,87.91
4IO21
  Top 0.203: 96.44,89.69 93.65,89.69 92.63,90.7 88.31,90.7 87.55,89.94 87.55,68.35 88.06,67.84 90.6,67.84 91.87,66.57
  Bottom 0.203: 111.56,85.74 111.56,87.27 111.17,87.66 108.12,87.66 106.09,89.69 96.44,89.69
4IO22
  Bottom 0.203: 91.87,84.35 92.88,85.37 93.14,85.62 93.14,87.4 95.93,90.2 96.44,90.7 105.84,90.7 106.35,90.2 108.38,88.16 113.97,88.16 115.37,86.76 115.37,85.74
4IO23
  Bottom 0.203: 89.33,84.35 90.6,85.62 90.6,87.4 91.36,88.16 93.14,88.16 96.19,91.21 106.09,91.21 108.63,88.67 114.73,88.67 116.64,86.76 116.64,85.74
4IO25
  Top 0.203: 89.33,74.19 90.6,72.92 92.63,72.92 98.73,66.83 99.23,66.32 103.81,66.32 104.31,65.81 105.84,65.81 106.35,66.32
  Bottom 0.203: 106.48,68.74 106.48,66.45 106.35,66.32
4IO26
  Top 0.203: 89.33,79.27 90.6,78 92.38,78 93.14,77.24 93.14,73.94 99.74,67.34 104.69,67.34 104.95,67.08
  Bottom 0.203: 105.21,68.74 105.21,67.34 104.95,67.08
4IO27
  Bottom 0.203: 103.94,68.74 103.94,67.47 101.77,65.3 90.6,65.3 89.33,64.03
4IO32
  Bottom 0.203: 109.02,68.74 109.02,65.95 107.11,64.03 91.87,64.03
4IO33
  Top 0.203: 91.87,74.19 92.12,74.19 98.98,67.34 99.49,66.83 104.06,66.83 104.57,66.32 105.33,66.32 106.09,67.08 107.62,67.08
  Bottom 0.203: 107.75,68.74 107.75,67.22 107.62,67.08
4IO34
  Top 0.203: 91.87,86.89 93.39,86.89 93.9,86.39 93.9,80.54 94.66,79.78 94.66,74.7 99.49,69.88 100.5,68.86 110.41,68.86 110.92,68.35 112.19,67.08
  Bottom 0.203: 111.56,68.74 111.56,67.71 112.19,67.08
4IO35
  Top 0.203: 110.16,67.08 109.39,67.84 100,67.84 93.65,74.19 93.65,79.27 92.38,80.54 90.6,80.54 89.33,81.81
  Bottom 0.203: 110.29,68.74 110.29,67.22 110.16,67.08
4RX0
  Top 0.61: 106.73,78.51 105.33,78.51 105.33,79.78
  Bottom 0.203: 112.83,85.74 112.83,84.74 110.41,82.32 107.87,82.32 106.6,82.32 105.33,81.05 105.33,79.78
4SVN
  Top 0.203: 89.33,86.89 90.6,85.62 92.63,85.62 93.39,84.86 93.39,80.29 94.15,79.53 94.15,74.45 99.49,69.11 100.25,68.35 109.14,68.35 109.9,68.35 111.17,67.08
  Bottom 0.203: 112.83,68.74 112.95,68.62 112.95,66.83 112.44,66.32 111.93,66.32 111.17,67.08
4SVP
  Top 0.203: 89.33,89.43 90.09,89.43 91.36,88.16 93.39,88.16 94.41,87.15 94.41,80.8 95.17,80.04 95.17,74.96 100.5,69.62 100.76,69.37 109.9,69.37 110.92,70.38
  Bottom 0.203: 114.1,68.74 114.1,70 113.71,70.38 110.92,70.38
4TX0
  Top 0.61: 106.73,75.97 105.58,75.97 105.33,76.23 105.33,77.24
  Bottom 0.203: 114.1,85.74 114.1,84.61 110.8,81.31 110.41,81.31 107.11,81.31 106.6,80.8 106.6,78.51 105.33,77.24
6EN  (via drill 0.38)
  Top 0.61: R206.1 2.42,19.88 v2.46,19.84 | C213.2 v6.27,1.55
  Bottom 0.61: IC206.RESET 6.23,1.59 v6.27,1.55 8.56,1.55 9.83,2.82 9.83,16.28 6.27,19.84 v2.46,19.84
6IO0  (via drill 0.38)
  Top 0.61: R210.1 v13.38,18.31
  Bottom 0.61: IC206.GPIO0 18.8,9.59 13.38,15.01 v13.38,18.31
6IO2  (via drill 0.38)
  Top 0.61: R211.1 v13.38,21.11
  Bottom 0.61: IC206.GPIO2 19.09,11.59 15.16,15.52 15.16,19.33 v13.38,21.11
6IO12  (via drill 0.38)
  Top 0.61: v6.52,11.71 6.52,9.93 6.78,9.68 15.16,9.68 15.41,9.42 J213.5
  Bottom 0.61: IC206.GPIO12 6.41,11.59 v6.52,11.71
6IO14  (via drill 0.38)
  Top 0.61: v8.3,10.69 10.08,10.69 10.33,10.95 J213.2
  Bottom 0.61: IC206.GPIO14 7.2,9.59 v8.3,10.69
6IO15  (via drill 0.38)
  Top 0.61: v18.21,14.76 R212.2
  Bottom 0.61: IC206.GPIO15 19.37,13.59 v18.21,14.76
6RX0  (via drill 0.38)
  Top 0.61: J213.3 v12.87,3.07
  Bottom 0.61: IC206.RXD0 19.21,3.59 18.21,4.6 14.4,4.6 v12.87,3.07
6TX0  (via drill 0.38)
  Top 0.61: v10.84,1.55 10.33,2.06 J213.1
  Bottom 0.61: IC206.TXD0 10.88,1.59 v10.84,1.55
+3V3  (via drill 0.38)
  Top 0.305: IC106.8 48.87,31.78 v48.66,31.57 | IC106.6 50.16,33.88 v50.44,33.6 | IC104.1 40.2,35.44 40,35.64 v39.01,35.64 | IC105.VDD 44.88,38.63 44.62,38.89 44.62,49.92 45.13,50.43 J109.3
  Top 0.61: J108.3 33.05,50.43 30.65,48.03 J103.1 26.59,51.84 26.59,66.83 SJ103.3 | LED101.A 6.61,30.62 v7.26,31.27
  Bottom 0.61: J108.3 42.85,50.43 | 42.85,50.43 J109.3 51.5,50.43 C116.2 | C106.2 50.47,33.63 v50.44,33.6 50.44,31.33 C103.2 50.2,31.57 v48.66,31.57 48.43,31.8 C111.2 46.95,34.79 45.89,35.84 | C117.2 42.85,50.43 | v7.26,31.27 11.35,31.27 | 11.35,31.27 23.54,31.27 | 23.54,31.27 25.07,31.27 | SJ102.1 23.29,31.52 23.54,31.27 | 25.07,48.67 IC103.2 19.86,48.67 16.18,52.35 16.18,54.64 10.84,59.97 J104.3 | 25.07,48.67 IC103.4 29.76,48.67 J103.1 33.19,48.03 33.45,47.78 | 25.07,31.27 25.07,44.22 | 25.07,44.22 25.07,48.67 | 33.45,45.24 C108.1 33.45,37.62 | 33.45,45.24 33.45,47.78 | 33.45,47.78 33.45,48.76 R106.1 | 33.45,37.62 33.45,35.08 34.43,34.1 C110.2 38.83,34.1 R107.1 38.78,34.06 38.78,35.59 | 38.78,35.59 C101.2 | 38.78,35.59 38.83,35.64 v39.01,35.64 39.21,35.84 45.89,35.84 | D101.A 24.94,44.1 25.07,44.22 | 33.45,37.62 33.41,37.66 R109.2 R112.1 | 45.89,35.84 45.89,38.13 46.36,38.6 R111.2 52.28,38.6 53.01,37.87 J105.1 | C107.1 33.45,45.24 | R3.2 C1.1 26.37,29.96 25.07,31.27 | IC102.2 10.97,38.51 11.35,38.13 11.35,33.81 | 11.35,33.81 11.35,31.27 | R104.2 11.1,33.55 11.35,33.81
+3V3_2
  Top 0.61: 98.47,49.05 102.03,49.05 103.3,47.78 103.3,36.09 104.78,34.61 110.41,34.61 111.39,34.61 112.95,34.61 | 112.95,34.61 114.73,34.61 | 114.98,31.01 114.98,34.35 114.73,34.61 | 114.73,34.61 116.33,34.61 116.51,34.79 | 117.27,51.33 117.27,41.17 116.38,40.29 112.95,40.29 112.95,34.61 | 115.56,58.22 114,58.22 113.97,58.19
  Bottom 0.61: 115.25,34.21 115.25,31.28 114.98,31.01 | 117.27,51.33 117.27,54.89 113.97,58.19
+3V3_3
  Top 0.61: 77.14,28.69 76.63,28.18 66.51,28.18 64.44,30.25 63.93,30.76 63.93,36.13 63.9,36.16 64.5,36.16 65.2,36.86 65.2,41.81 65.2,52.35 65.67,52.82 66.47,52.82 69.22,52.82 69.26,52.86 | 67.74,58.74 69.26,58.74 69.26,53.62 | 69.01,49.43 69.13,49.43 69.26,49.56 69.26,52.86 | 69.26,52.86 69.26,53.62 | 79.17,53.37 69.52,53.37 69.26,53.62
  Bottom 0.61: 79.17,53.37 77.8,53.37 77.72,53.28 | 65.2,41.81 79.04,41.81 83.23,37.62
+3V3_4
  Top 0.61: 116.29,75.46 116.51,75.46 | 116.51,75.46 116.51,84.35 | 116.51,84.35 116.51,89.43 | 111.61,84.58 116.28,84.58 116.51,84.35 | 100.38,73.43 100.76,73.43 102.54,71.65 109.9,71.65 110.41,72.16 111.43,72.16 111.93,71.65 112.7,70.89 116.51,70.89 | 116.51,75.46 116.51,72.42 | 116.51,72.42 116.51,70.89 | 116.51,70.89 116.51,69.37 | 116.51,69.37 116.51,67.59 114.98,66.07 | 116.29,69.37 116.51,69.37 | 116.29,72.42 116.51,72.42
  Bottom 0.61: 91.87,91.97 92.12,91.97 93.65,93.5 96.95,93.5 98.73,95.28 108.12,95.28 109.14,94.26 109.14,90.96 110.66,89.43 116.51,89.43 | 114.98,66.07 116,66.07 116.64,66.71 116.64,68.74
+3V3_6  (via drill 0.38)
  Top 0.61: R208.2 4.02,15.77 | 4.02,15.77 C214.2 C215.2 R206.2 | 4.02,15.77 v6.27,15.77 6.69,16.19 6.69,16.54 | J213.6 15.41,16.03 14.91,16.54 6.69,16.54 | LED201.A LED202.A 6.69,16.54
  Bottom 0.61: IC206.VCC 6.09,15.59 v6.27,15.77
+3V3_S  (via drill 0.38)
  Top 0.203: 80.41,14.51 80.41,13.04 80.48,12.98
  Top 0.254: 82.77,13.05 82.77,12.26 v82.22,11.71 | 84.06,13.05 84.06,12.4 v84.76,11.71
  Top 0.61: 127.43,17.81 127.43,20.13 127.34,20.22 | 110.12,19.58 110.12,18.57 | 110.12,18.57 110.12,17.55 | 80.01,19.58 78.41,19.58 78.11,19.88 76.37,19.88 74.34,19.88 v74.34,20.85 70.79,20.85 70.6,20.67 70.6,19.61 | 74.3,15.01 74.3,16.24 v74.34,16.28 | v84.76,11.71 86.24,11.71 | 114.47,2.02 119.55,2.02 | 119.55,2.02 119.99,2.02 120.28,2.31 | 119.81,4.85 119.81,2.27 119.55,2.02 | 80.48,10.95 80.48,11.71 | 80.48,11.71 80.48,12.98 | v82.22,11.71 80.48,11.71 | 110.12,18.57 107.87,18.57 v107.87,19.84
  Bottom 0.61: 74.34,19.88 v74.34,16.28 74.34,11.71 v82.22,11.71 v84.76,11.71 | 74.34,19.88 v74.34,20.85 | 108.38,5.36 109.65,4.09 119.05,4.09 119.81,4.85 122.6,7.65 127.43,7.65 130.22,10.44 130.22,15.01 127.43,17.81 125.14,20.09 107.87,20.09 | 107.87,20.09 74.56,20.09 74.34,19.88 | v107.87,19.84 107.87,20.09
+5V  (via drill 0.38)
  Top 0.61: SJ101.2 31.42,88.16 32.18,88.93 J102.2 | v38.53,43.71 30.91,43.71 24.05,50.57 IC101.OUT+ 24.05,71.65 | 24.05,71.65 24.05,81.56 v26.59,84.1 | SJ103.2 24.3,71.91 24.05,71.65
  Bottom 0.61: C104.1 39.29,42.7 | 39.29,42.7 39.29,42.95 v38.53,43.71 | C105.1 39.29,42.7 | v26.59,84.1 26.59,91.21 27.1,91.72 31.92,91.72 J102.2 | 21.76,54.38 18.72,54.38 10.59,62.51 J104.5 | 21.76,54.38 IC101.OUT+ | IC103.3 21.46,54.08 21.76,54.38
+5V1
  Top 0.61: 70.6,17.01 70.6,14.91 70.62,14.89 | 68.25,15.02 70.49,15.02 70.62,14.89 | 70.62,14.89 70.62,13.23 | 70.62,13.23 70.62,10.35 71.04,9.93 71.6,9.93 71.61,9.92 | 72.31,13.27 70.66,13.27 70.62,13.23
+5V_2
  Top 0.61: 115.71,53.62 115.56,53.77 115.56,55.62 113.46,55.62 112.22,55.62 111.72,56.12 110.66,57.18 106.6,57.18 106.35,56.92 104.06,56.92 103.81,56.92 102.54,56.92 101.77,56.92 | 102.03,57.39 102.07,57.39 102.07,57.21 101.77,56.92 | 101.77,56.92 98.98,56.92 98.73,56.67
  Bottom 0.406: 107.11,54.38 107.33,54.61 107.33,55.57
  Bottom 0.61: 98.47,46.51 101.01,49.05 101.01,54.38 | 101.01,54.38 98.73,56.67 | 107.11,54.38 101.01,54.38
+5V_3
  Top 0.61: 68.75,37.33 68.75,36.35 | 68.75,36.35 68.75,36.09 | 68.75,36.09 68.75,34.86 | 66.5,36.16 68.69,36.16 68.75,36.09 | 81.51,33.81 81.51,36.35 | 81.51,36.35 81.51,38.43 83.23,40.16 | 68.75,36.35 81.51,36.35
  Bottom 0.406: 73.86,33.13 73.86,33.33 74.09,33.55
  Bottom 0.61: 74.09,33.55 74.14,33.55 75.16,34.57 80.74,34.57 81.51,33.81 81.51,33.76 83.23,32.03 83.23,30.25
+5V_4
  Top 0.61: 111.61,87.18 111.61,88.93 | 111.46,88.93 111.61,88.93 | 111.82,90.83 108.25,90.83 107.62,91.47 | 113.67,91.21 112.2,91.21 111.82,90.83 | 111.61,88.93 111.61,90.62 111.82,90.83
  Bottom 0.406: 112.67,91.89 112.67,91.68 111.82,90.83
  Bottom 0.61: 91.87,89.43 93.39,89.43 95.93,91.97 107.11,91.97 107.62,91.47
+5V_S  (via drill 0.38)
  Top 0.61: 62.66,18.82 68.24,18.82 | 68.24,18.82 68.25,18.82 | 68.24,18.82 v68.24,20.34 v68.25,20.35 | 90.18,7.39 90.18,9.84 v90.09,9.93 | 95.08,7.39 95.08,9.77 v94.92,9.93 | 80.69,3.87 82.72,3.87 | 82.72,3.87 83.23,3.87 | 82.72,3.87 82.75,3.9 82.75,6.19 83.93,6.19 v83.99,6.12 | 73.51,9.92 74.58,9.92 v74.6,9.93 | 68.28,11.96 68.28,10.73 v68.25,10.69
  Bottom 0.61: 108.38,7.9 106.35,9.93 v94.92,9.93 v90.09,9.93 84.25,9.93 | 83.74,9.93 84.25,9.93 | 82.72,9.92 84.23,9.92 84.25,9.93 | v83.99,6.12 82.72,7.39 82.72,9.92 | 82.72,9.92 74.61,9.92 v74.6,9.93 69.01,9.93 v68.25,10.69 v68.25,20.35
+12V
  Top 0.61: J101.3 40.56,89.69 39.8,88.93 34.46,88.93 31.67,86.13 | 31.67,86.13 SJ101.1 24.05,86.13 IC101.IN+ | 31.67,86.13 31.67,76.99 33.7,74.96 SJ104.2
A(CS_CLK)
  Bottom 0.203: IC108.18 35.86,62.89 37.51,61.24 38.78,61.24 40.05,62.51 J107.8 47.93,69.62 J106.9
B(CS)
  Top 0.203: J106.10 52.5,69.62 53.26,68.86 53.26,60.99 52.5,60.22 42.85,60.22 41.83,61.24 39.54,61.24 J107.7
  Bottom 0.203: IC108.17 36.62,64.16 J107.7
BLUE1  (via drill 0.38)
  Top 0.203: v44.62,82.07 44.62,79.53 46.91,77.24 J106.3
  Bottom 0.203: v44.62,82.07 44.37,81.81 41.45,81.81 40.69,82.58 31.92,82.58 31.8,82.45 IC107.16
BLUE2  (via drill 0.38)
  Top 0.203: v38.02,85.12 v38.02,79.27
  Bottom 0.203: IC107.13 31.54,86.26 33.07,87.78 35.86,87.78 38.02,85.62 v38.02,85.12 | 45.89,74.7 46.15,74.45 | 46.15,74.45 J106.7 | v38.02,79.27 41.32,79.27 46.15,74.45
BUZ
  Bottom 0.406: R108.1 32.81,76.62 HA101.A
BUZZER
  Bottom 0.406: IC108.11 31.29,71.78 32.81,73.31 R108.2
C(LOCK)  (via drill 0.38)
  Top 0.203: v33.45,65.43 33.45,61.24 36.24,58.45 39.29,58.45 J107.10
  Bottom 0.203: J106.11 47.93,67.08 J107.10 | IC108.16 v33.45,65.43
CHG
  Top 0.61: 80.15,8.09 80.15,9.14 80.44,9.42 85.77,9.42 86.28,8.92 86.28,4.71 85.52,3.95
CLOCK  (via drill 0.38)
  Top 0.203: J106.13 46.91,64.54 44.88,66.57 44.88,74.7 40.56,79.02 40.56,83.85 v39.54,84.86
  Bottom 0.203: IC107.12 31.54,87.53 32.3,88.29 36.62,88.29 39.54,85.37 v39.54,84.86
D(ATA)  (via drill 0.38)
  Top 0.203: v34.97,66.32 34.97,61.24 36.24,59.97 J107.9
  Bottom 0.203: J107.9 39.54,61.24 41.32,61.24 41.96,61.88 41.96,62.38 47.93,68.35 49.7,68.35 J106.12 | IC108.15 34.59,66.7 v34.97,66.32
E
  Bottom 0.203: J106.8 49.7,70.89 46.91,70.89 45.89,71.91 37,71.91 33.07,67.97 IC108.14
EN_S
  Top 0.203: 104.49,4.77 106.68,4.77 107.36,4.09 109.65,4.09 110.92,2.82
  Top 0.61: 114.47,5.58 114.47,3.62 114.44,3.58 113.2,3.58 112.44,2.82 110.92,2.82
EN_S_P
  Top 0.61: 72.5,17.01 72.5,15.16 72.22,14.89
GND  (via drill 0.38)
  other vias: 21.26,18.57 20.24,17.55 21.26,17.55 20.24,18.57
  pour Top: 57.14,0 57,96.25 0,96.25 0,0.25
  pour Bottom: 57,0.25 57,96.25 0,96.25 0,0.25
GND1
  pour Top: 118.53,26.25 118.53,96.25 61.53,96.25 61.53,26.25
  pour Bottom: 118.53,26.25 118.53,96.25 61.53,96.25 61.53,26.25
GREEN1
  Bottom 0.203: J106.2 49.45,81.31 41.32,81.31 40.56,82.07 32.18,82.07 31.29,81.18 IC107.17
GREEN2  (via drill 0.38)
  Top 0.203: v41.83,83.08 41.83,79.27 47.67,73.43 49.7,73.43 J106.6
  Bottom 0.203: IC107.14 31.29,84.99 32.69,83.59 41.32,83.59 v41.83,83.08
I2C_SCL  (via drill 0.38)
  Top 0.203: v13.38,55.14 17.19,55.14 19.48,57.43 v19.48,57.94
  Top 0.305: IC104.6 44.88,34.82 | 44.88,34.82 45.13,34.82 45.42,34.53 IC106.4 | 44.88,34.82 44.96,34.89 44.96,37.56 44.88,37.63 | IC105.SCK 44.88,37.63 | J108.1 43.1,46.43 43.61,45.92 43.61,37.63 | J105.4 47.67,29.24 44.88,32.03 40.05,32.03 37.77,34.32 37.77,36.86 38.54,37.63 43.61,37.63 | 44.88,37.63 43.61,37.63
  Bottom 0.203: IC102.16 16.05,37.24 11.35,41.94 11.35,54.13 12.37,55.14 v13.38,55.14 | J108.1 39.37,46.43 37,48.79 37,52.1 31.16,57.94 v19.48,57.94 19.22,57.94 9.57,67.59 J104.9
  Bottom 0.406: IC102.16 21.47,37.24 R113.2
  Bottom 0.61: J108.1 J109.1
I2C_SCL_S  (via drill 0.38)
  Top 0.203: 77.41,14.51 78.41,14.51 78.66,14.76 78.66,17.04 79.42,17.81 79.93,17.81 | 84.72,15.2 84.72,15.45 84.72,17.77 84.76,17.81 | 80.01,18.58 80.01,17.88 79.93,17.81 | 79.93,17.81 84.76,17.81 | 84.76,17.81 86.28,17.81 v86.28,18.06 | 104.02,18.57 103.3,18.57 v102.54,17.81 102.54,14 103.55,12.98 108.38,12.98
  Bottom 0.203: 119.81,17.81 v102.54,17.81 86.53,17.81 v86.28,18.06
I2C_SDA  (via drill 0.38)
  Top 0.203: v13.13,53.62 14.14,54.64 17.45,54.64 20.24,57.43 v20.24,58.7
  Top 0.305: IC104.4 45.38,33.82 45.39,33.81 45.46,33.88 IC106.3 47.49,33.88 47.67,34.06 47.67,35.33 49.12,36.78 IC105.DATA 50.96,37.63 50.97,37.62 | J109.2 47.42,48.43 46.66,47.67 46.66,41.17 46.91,40.92 50.47,40.92 50.97,40.41 50.97,37.62 | J105.2 52.24,34.32 50.97,35.59 50.97,37.62
  Bottom 0.203: IC102.15 16.05,38.51 12.37,42.19 12.37,52.86 v13.13,53.62 | J108.2 38.13,48.43 37.51,49.05 37.51,52.22 31.29,58.45 20.49,58.45 v20.24,58.7 19.22,58.7 10.59,67.34 10.59,68.1 9.83,68.86 8.05,68.86 J104.10
  Bottom 0.406: IC102.15 21.34,38.51 R114.2
  Bottom 0.61: J109.2 J108.2
I2C_SDA_S  (via drill 0.38)
  Top 0.203: 77.41,15.51 77.41,16.77 v77.39,16.79 | 83.41,18.58 84.74,18.58 v84.76,18.57 | 84.06,15.45 84.06,16.47 v83.74,16.79 | 104.02,16.28 104.02,16.24 103.81,16.03 v103.81,14.76
  Bottom 0.203: 124.89,17.81 124.89,15.27 124.38,14.76 110.92,14.76 | v77.39,16.79 v83.74,16.79 84.76,16.79 | 110.92,14.76 110.92,12.98 | 110.92,14.76 v103.81,14.76 85.77,14.76 84.76,15.77 84.76,16.79 | v84.76,18.57 84.76,16.79
IN2_A
  Bottom 0.203: 93.65,35.59 95.17,35.59 95.93,36.35
IN2_LED
  Bottom 0.203: 93.65,39.65 95.17,39.65 95.93,38.89
IN3_A
  Bottom 0.61: 88.57,51.08 86.53,51.08 85.77,50.32
IN3_DHT
  Bottom 0.203: 83.23,42.7 83.99,42.7 85.26,41.43 87.8,41.43 88.57,42.19
IN3_LED
  Bottom 0.61: 88.57,47.02 86.53,47.02 85.77,47.78
IN_A
  Bottom 0.203: J104.14 8.05,71.4 9.83,71.4 19.6,61.62 IC108.2
IN_B
  Bottom 0.203: IC108.3 19.1,62.89 J104.13
IN_BLUE1
  Bottom 0.203: IC107.4 9.95,81.18 9.57,81.56 8.05,81.56 J104.22
IN_BLUE2
  Bottom 0.203: IC107.7 9.7,84.99 J104.23
IN_BUZZER  (via drill 0.38)
  Top 0.203: J104.11 10.08,70.89 v18.21,70.89
  Bottom 0.203: IC108.9 18.59,70.51 v18.21,70.89
IN_C
  Bottom 0.203: J104.16 8.05,73.94 9.83,73.94 19.6,64.16 IC108.4
IN_CLOCK
  Bottom 0.203: IC107.8 9.95,86.26 9.57,86.64 8.05,86.64 J104.26
IN_D
  Bottom 0.203: IC108.5 19.1,65.43 J104.15
IN_DHT
  Bottom 0.203: J103.2 28.62,52.35 28.62,53.87 25.83,56.67 18.46,56.67 10.08,65.05 J104.7
  Bottom 0.61: J103.2 33.16,50.57 R106.2
IN_DHT_S
  Top 0.203: 122.35,4.85 122.35,5.61 120.06,7.9 115.74,7.9 114.47,9.17 109.65,9.17 108.38,10.44
  Top 0.61: 122.35,4.85 122.35,2.78 121.88,2.31
IN_E
  Bottom 0.203: J104.18 8.05,76.48 9.83,76.48 10.59,75.72 10.59,74.7 18.59,66.7 IC108.6
IN_GREEN1
  Bottom 0.203: IC107.3 9.7,79.91 J104.19
IN_GREEN2
  Bottom 0.203: IC107.6 9.95,83.72 9.57,84.1 8.05,84.1 J104.24
IN_LATCH
  Bottom 0.203: IC107.9 9.7,87.53 J104.25
IN_LED  (via drill 0.38)
  Top 0.203: J104.12 8.05,68.86 16.68,68.86 v17.45,69.62
  Bottom 0.203: IC108.8 17.83,69.24 v17.45,69.62
IN_OE
  Bottom 0.203: IC108.7 18.08,67.97 11.1,74.96 11.1,75.97 J104.17
IN_RED1
  Bottom 0.203: IC107.2 10.97,78.64 10.59,79.02 8.05,79.02 J104.20
IN_RED2
  Bottom 0.203: IC107.5 9.7,82.45 J104.21
LATCH
  Bottom 0.203: IC107.11 37.38,88.8 41.58,84.61 48.69,84.61 53.26,80.04 53.26,66.83 J106.14
LED
  Bottom 0.406: R110.2 26.5,70.64 26.63,70.51 IC108.12
N$1
  Bottom 0.61: D101.C D102.C 21.51,42.05 21.51,41.17 20.11,39.78 IC102.14
N$2  (via drill 0.38)
  Top 0.305: LED103.A 49.79,44.13 v49.7,44.22
  Bottom 0.61: v49.7,44.22 R111.1
N$3
  Top 0.61: 67.74,55.91 67.74,57.14
  Bottom 0.61: 67.72,53.28 67.72,55.88 67.74,55.91
N$4
  Bottom 0.203: SJ1.3 31.92,28.47 32.69,27.71 43.35,27.71 J1.3
  Bottom 0.61: SJ1.3 R3.1
N$5  (via drill 0.38)
  Top 0.305: LED102.A 51.9,54.72 50.47,56.16
  Top 0.406: 50.47,56.16 34.46,56.16 v28.11,62.51
  Bottom 0.406: R110.1 24.9,65.72 v28.11,62.51
N$6
  Bottom 0.406: -0.04,-3.49 -0.04,96.51
N$7  (via drill 0.38)
  Top 0.61: LED101.C 4.91,37.83 v4.62,38.13
  Bottom 0.61: R105.2 4.58,38.16 v4.62,38.13
N$8
  Bottom 0.203: SJ1.2 33.45,32.79 37,29.24 J1.1
  Bottom 0.61: SJ1.2 R4.2
N$9  (via drill 0.38)
  Top 0.61: R208.1 2.42,5.91 v2.71,5.61
  Bottom 0.61: IC206.CH_PD 2.74,5.59 v2.71,5.61
N$10  (via drill 0.38)
  Top 0.61: v6.27,3.58 R207.1
  Bottom 0.61: IC206.ADC 6.26,3.59 v6.27,3.58
N$11
  Top 0.61: R210.2 LED202.C
N$12
  Top 0.61: R211.2 LED201.C
N$13
  Bottom 0.406: -0.04,-3.49 99.96,-3.49
N$14
  Top 0.61: 105.62,18.57 105.62,16.28 105.88,16.54 107.87,16.54
N$15
  Top 0.61: 83.23,2.27 85.44,2.27 85.52,2.2
N$16  (via drill 0.38)
  Top 0.406: 90.34,14.5 97.46,14.5 97.96,14 v97.96,8.41
  Top 0.61: 82.75,8.09 84.31,8.09 v84.76,7.65
  Bottom 0.406: v84.76,7.65 85.77,8.66 97.71,8.66 v97.96,8.41
N$18
  Top 0.61: 87.84,16.03 89.84,16.03 90.34,16.54
N$19
  Top 0.61: 87.84,14 88.82,14 90.34,12.47
N$20
  Top 0.203: 118.28,11.46 117.78,11.96 117.78,18.31 116.51,19.58 113.97,19.58
  Top 0.61: 111.72,19.58 113.97,19.58
N$21
  Top 0.203: 113.97,15.52 114.22,15.52 114.98,14.76 114.98,9.93 116,8.92 120.82,8.92 123.36,11.46
  Top 0.61: 111.72,15.52 113.97,15.52
N$24
  Top 0.203: 77.41,15.01 75.9,15.01
  Top 0.61: 75.9,15.01 75.9,12.98
N$25  (via drill 0.38)
  Top 0.305: IC104.5 42.31,34.32 v41.98,33.99
  Bottom 0.61: C109.1 42.05,34.06 v41.98,33.99 41.92,34.06 R107.2
N$26
  Top 0.254: 91.38,7.39 91.38,8.68 91.61,8.92 92.38,8.92 | 92.38,8.92 94.15,8.92 94.38,8.69 94.38,7.39 | 92.38,9.64 92.38,8.92
N$27
  Top 0.254: 110.92,7.9 109.65,6.63 107.62,6.63 106.35,7.9 102.57,7.9 102.57,9.93
N$28
  Top 0.61: 71.58,5.48 70.45,6.61 66.36,6.61 66.36,9.53 64.18,11.71 61.13,11.71
N$32
  Bottom 0.406: R104.1 8.26,36.34 IC102.1
N$39
  Bottom 0.406: R114.1 R113.1 23.33,34.99 SJ102.2
N$52  (via drill 0.38)
  Top 0.61: G101.+ G102.+ 16.4,34.66 G103.P1"+" 16.4,40.13 16.94,40.67 v23.54,40.67
  Bottom 0.61: D102.A 23.53,40.68 v23.54,40.67
OE  (via drill 0.38)
  Top 0.203: J106.15 47.42,62 43.61,65.81 v43.61,73.18
  Bottom 0.203: v43.61,73.18 36.75,73.18 32.81,69.24 IC108.13
PHOTO_RES  (via drill 0.38)
  Top 0.203: J104.8 4.24,62.51 4.24,52.6 5.25,51.59 10.08,51.59 10.84,50.83 10.84,43.21 12.11,41.94 24.81,41.94 26.34,40.41 26.34,34.57 29.89,31.01 | J1.2 42.08,29.24 40.31,31.01 29.89,31.01 | v29.89,30.51 29.89,31.01
  Bottom 0.203: SJ1.1 30.15,30.76 v29.89,30.51
PHOTO_RES1  (via drill 0.38)
  Top 0.203: 120.82,11.46 119.3,9.93 116.76,9.93 v116.25,10.44 116.25,17.04 115.74,17.55 113.97,17.55
  Bottom 0.203: 110.92,10.44 v116.25,10.44
PRG_BTN  (via drill 0.38)
  Top 0.203: 31.61,36.28 31.61,36.67 | 31.92,36.28 25.26,42.95 12.62,42.95 11.86,43.71 11.86,54.89 J104.1
  Top 0.61: SW101.B 31.92,36.28 31.61,36.28 31.42,36.09 v31.42,34.57
  Bottom 0.61: v31.42,34.57 R109.1
RED1
  Bottom 0.203: IC107.18 31.29,79.91 32.94,81.56 40.43,81.56 41.2,80.8 47.42,80.8 J106.1
RED2  (via drill 0.38)
  Top 0.203: v43.23,82.58 43.23,79.4 47.93,74.7 J106.5
  Bottom 0.203: IC107.15 31.8,83.72 32.43,83.08 40.81,83.08 41.58,82.32 42.97,82.32 v43.23,82.58
RET
  cutout Bottom: 56,25.25 24,25.25 24,1.25 23,1.25 23,25.25 1,25.25 1,26.25 56,26.25
  cutout Top: 56,25.25 24,25.25 24,1.25 23,1.25 23,25.25 1,25.25 1,26.25 56,26.25
RET1
  cutout Bottom: 117.53,60.25 91.53,60.25 91.53,27.25 90.53,27.25 90.53,60.25 63.53,60.25 63.53,61.25 117.53,61.25
  cutout Top: 63.53,61.25 117.53,61.25 117.53,60.25 91.53,60.25 91.53,27.25 90.53,27.25 90.53,60.25 63.53,60.25
RST_BTN  (via drill 0.38)
  Top 0.203: SW102.B 28.62,36.41 28.62,38.89 25.07,42.44 12.37,42.44 11.35,43.46 11.35,53.11 7.03,57.43 J104.2
  Top 0.61: SW102.B v28.88,34.57
  Bottom 0.61: C112.2 R112.2 29.51,35.2 v28.88,34.57
SQW
  Bottom 0.203: J104.6 5.76,62.51 4.24,60.99 4.24,52.6 6.18,50.66 R105.1
  Bottom 0.406: IC102.3 R105.1
V_BAT  (via drill 0.38)
  Top 0.254: 100.97,7.9 v99.49,7.9
  Top 0.61: 74.6,7.48 76.25,7.48 76.08,7.32 76.08,6.63 | 74.6,7.48 72.9,7.48 72.56,7.82 | 74.58,5.48 74.58,7.47 74.6,7.48 | 76.08,5.48 76.08,6.63 | 76.08,6.63 76.34,6.38 v77.64,6.38 77.83,6.19 80.15,6.19
  Bottom 0.254: v99.49,7.9 99.49,5.36 98.47,4.34 79.68,4.34 v77.64,6.38
V_SPI
  Top 0.61: J107.1 SJ104.1
  Bottom 0.61: J107.1 J107.2 44.03,70.13 C113.1
VCC  (via drill 0.4)
  Top 0.61: SJ104.3 30.4,68.1 | 30.4,68.1 30.4,69.88 | 30.4,69.88 30.4,73.94 v28.62,75.72 | SJ103.1 30.4,69.88 | 30.4,68.1 30.4,62.51 v32.43,60.48
  Bottom 0.61: 32.43,60.35 IC108.20 IC108.1 | 32.43,60.35 34.05,60.35 C115.1 | C114.1 30.27,77.29 | 30.27,77.29 IC107.20 | IC107.1 20.37,77.29 28.62,77.29 | v32.43,60.48 32.43,60.35 | 30.27,77.29 28.62,77.29 | v28.62,75.72 28.62,77.29

### Text on the board
tPlace: +5V | + | - | R1 | G1 | +12V | B1 | SPI | 5V | R2 | G2 | 12V | B2 | VCC | E | B | A | VCC | C | D | 3V | GND | CK | LA | CS | WR | OE | GND | SDA | SCL | EN GD SQ FR SD LD _A _C _E R1 B1 G2 CK | PG 3V 5V DH SC SN _B _D OE G1 R2 B2 LT | HUB75 | GND | VCC | DHT22 | SDA | i2c | SDA | VCC | SCL | VCC | SCL | 3V | 0 | G | RX | TX | RST
bPlace: +5V | EN GD SQ FR SD LD _A _C _E R1 B1 G2 CK | PG 3V 5V DH SC SN _B _D OE G1 R2 B2 LT | G SdA | +5V | 3V35V DH ScL